# Altium schematic sheet module_adapters.SchDoc
size A4
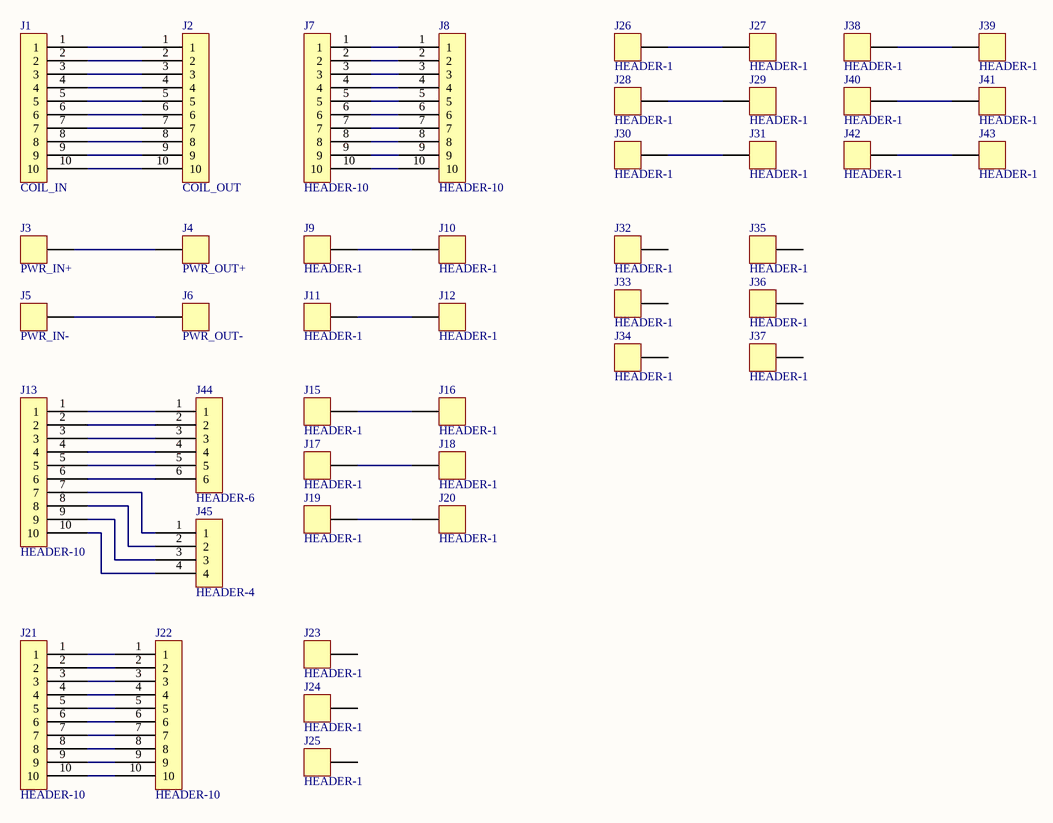
[diagram p0: module_adapters.SchDoc]

## Parts
J1  COIL_IN  [MICRO-MATCH-10]
J2  COIL_OUT  [MICRO-MATCH-MOB-10]
J3  PWR_IN+  [HIGH-POWER-VIA]
J4  PWR_OUT+  [2MM-BANANA-VIA]
J5  PWR_IN-  [HIGH-POWER-VIA]
J6  PWR_OUT-  [2MM-BANANA-VIA]
J7  HEADER-10  [MICRO-MATCH-10]
J8  HEADER-10  [MICRO-MATCH-10]
J9  HEADER-1  [2MM-BULLET-PLUG-VIA]
J10  HEADER-1  [HIGH-POWER-VIA]
J11  HEADER-1  [2MM-BULLET-PLUG-VIA]
J12  HEADER-1  [HIGH-POWER-VIA]
J13  HEADER-10  [MICRO-MATCH-10]
J15  HEADER-1  [2MM-BULLET-PLUG-VIA]
J16  HEADER-1  [2MM-BANANA-VIA]
J17  HEADER-1  [2MM-BULLET-PLUG-VIA]
J18  HEADER-1  [2MM-BANANA-VIA]
J19  HEADER-1  [2MM-BULLET-PLUG-VIA]
J20  HEADER-1  [2MM-BANANA-VIA]
J21  HEADER-10  [MICRO-MATCH-10]
J22  HEADER-10  [MICRO-MATCH-MOB-10]
J23  HEADER-1  [2MM-BANANA-VIA]
J24  HEADER-1  [2MM-BANANA-VIA]
J25  HEADER-1  [2MM-BANANA-VIA]
J26  HEADER-1  [2MM-BULLET-PLUG-VIA]
J27  HEADER-1  [HIGH-POWER-VIA]
J28  HEADER-1  [2MM-BULLET-PLUG-VIA]
J29  HEADER-1  [HIGH-POWER-VIA]
J30  HEADER-1  [2MM-BULLET-PLUG-VIA]
J31  HEADER-1  [HIGH-POWER-VIA]
J32  HEADER-1  [2MM-BANANA-VIA]
J33  HEADER-1  [2MM-BANANA-VIA]
J34  HEADER-1  [2MM-BANANA-VIA]
J35  HEADER-1  [2MM-BANANA-VIA]
J36  HEADER-1  [2MM-BANANA-VIA]
J37  HEADER-1  [2MM-BANANA-VIA]
J38  HEADER-1  [2MM-BULLET-PLUG-VIA]
J39  HEADER-1  [HIGH-POWER-VIA]
J40  HEADER-1  [2MM-BULLET-PLUG-VIA]
J41  HEADER-1  [HIGH-POWER-VIA]
J42  HEADER-1  [2MM-BULLET-PLUG-VIA]
J43  HEADER-1  [HIGH-POWER-VIA]
J44  HEADER-6  [MICRO-MATCH-6]
J45  HEADER-4  [MICRO-MATCH-4]

## Nets
NetJ1_1: J1.1 J2.1
NetJ1_2: J1.2 J2.2
NetJ1_3: J1.3 J2.3
NetJ1_4: J1.4 J2.4
NetJ1_5: J1.5 J2.5
NetJ1_6: J1.6 J2.6
NetJ1_7: J1.7 J2.7
NetJ1_8: J1.8 J2.8
NetJ1_9: J1.9 J2.9
NetJ1_10: J1.10 J2.10
NetJ3_1: J3.1 J4.1
NetJ5_1: J5.1 J6.1
NetJ7_1: J7.1 J8.1
NetJ7_2: J7.2 J8.2
NetJ7_3: J7.3 J8.3
NetJ7_4: J7.4 J8.4
NetJ7_5: J7.5 J8.5
NetJ7_6: J7.6 J8.6
NetJ7_7: J7.7 J8.7
NetJ7_8: J7.8 J8.8
NetJ7_9: J7.9 J8.9
NetJ7_10: J7.10 J8.10
NetJ9_1: J9.1 J10.1
NetJ11_1: J11.1 J12.1
NetJ13_1: J13.1 J44.1
NetJ13_2: J13.2 J44.2
NetJ13_3: J13.3 J44.3
NetJ13_4: J13.4 J44.4
NetJ13_5: J13.5 J44.5
NetJ13_6: J13.6 J44.6
NetJ13_7: J13.7 J45.1
NetJ13_8: J13.8 J45.2
NetJ13_9: J13.9 J45.3
NetJ13_10: J13.10 J45.4
NetJ15_1: J15.1 J16.1
NetJ17_1: J17.1 J18.1
NetJ19_1: J19.1 J20.1
NetJ21_1: J21.1 J22.1
NetJ21_2: J21.2 J22.2
NetJ21_3: J21.3 J22.3
NetJ21_4: J21.4 J22.4
NetJ21_5: J21.5 J22.5
NetJ21_6: J21.6 J22.6
NetJ21_7: J21.7 J22.7
NetJ21_8: J21.8 J22.8
NetJ21_9: J21.9 J22.9
NetJ21_10: J21.10 J22.10
NetJ26_1: J26.1 J27.1
NetJ28_1: J28.1 J29.1
NetJ30_1: J30.1 J31.1
NetJ38_1: J38.1 J39.1
NetJ40_1: J40.1 J41.1
NetJ42_1: J42.1 J43.1

Not connected (* = marked no-connect by the designer): J23 1; J24 1; J25 1; J32 1; J33 1; J34 1; J35 1; J36 1; J37 1

## Library data of the parts
J1 J2 = HEADER-10
J3-J6 = HEADER-1